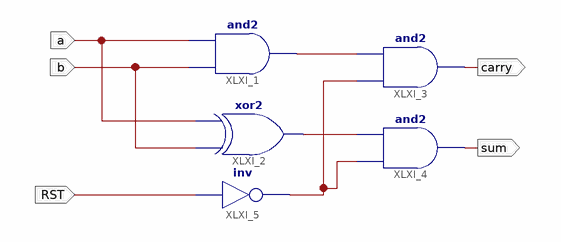
[diagram p0: schematic sheet 1]
// Xilinx ISE schematic half_adder.sch (artix7) as structural Verilog: 5 symbols, 5 ports
module half_adder (
  input  a,
  input  b,
  input  RST,
  output sum,
  output carry
);

  wire XLXN_2, XLXN_9, XLXN_10;

  and XLXI_1 (XLXN_9, b, a);
  xor XLXI_2 (XLXN_10, b, a);
  and XLXI_3 (carry, XLXN_2, XLXN_9);
  and XLXI_4 (sum, XLXN_2, XLXN_10);
  not XLXI_5 (XLXN_2, RST);
endmodule
